# EAGLE design BPW5017-VGA (EAGLE 5.11)
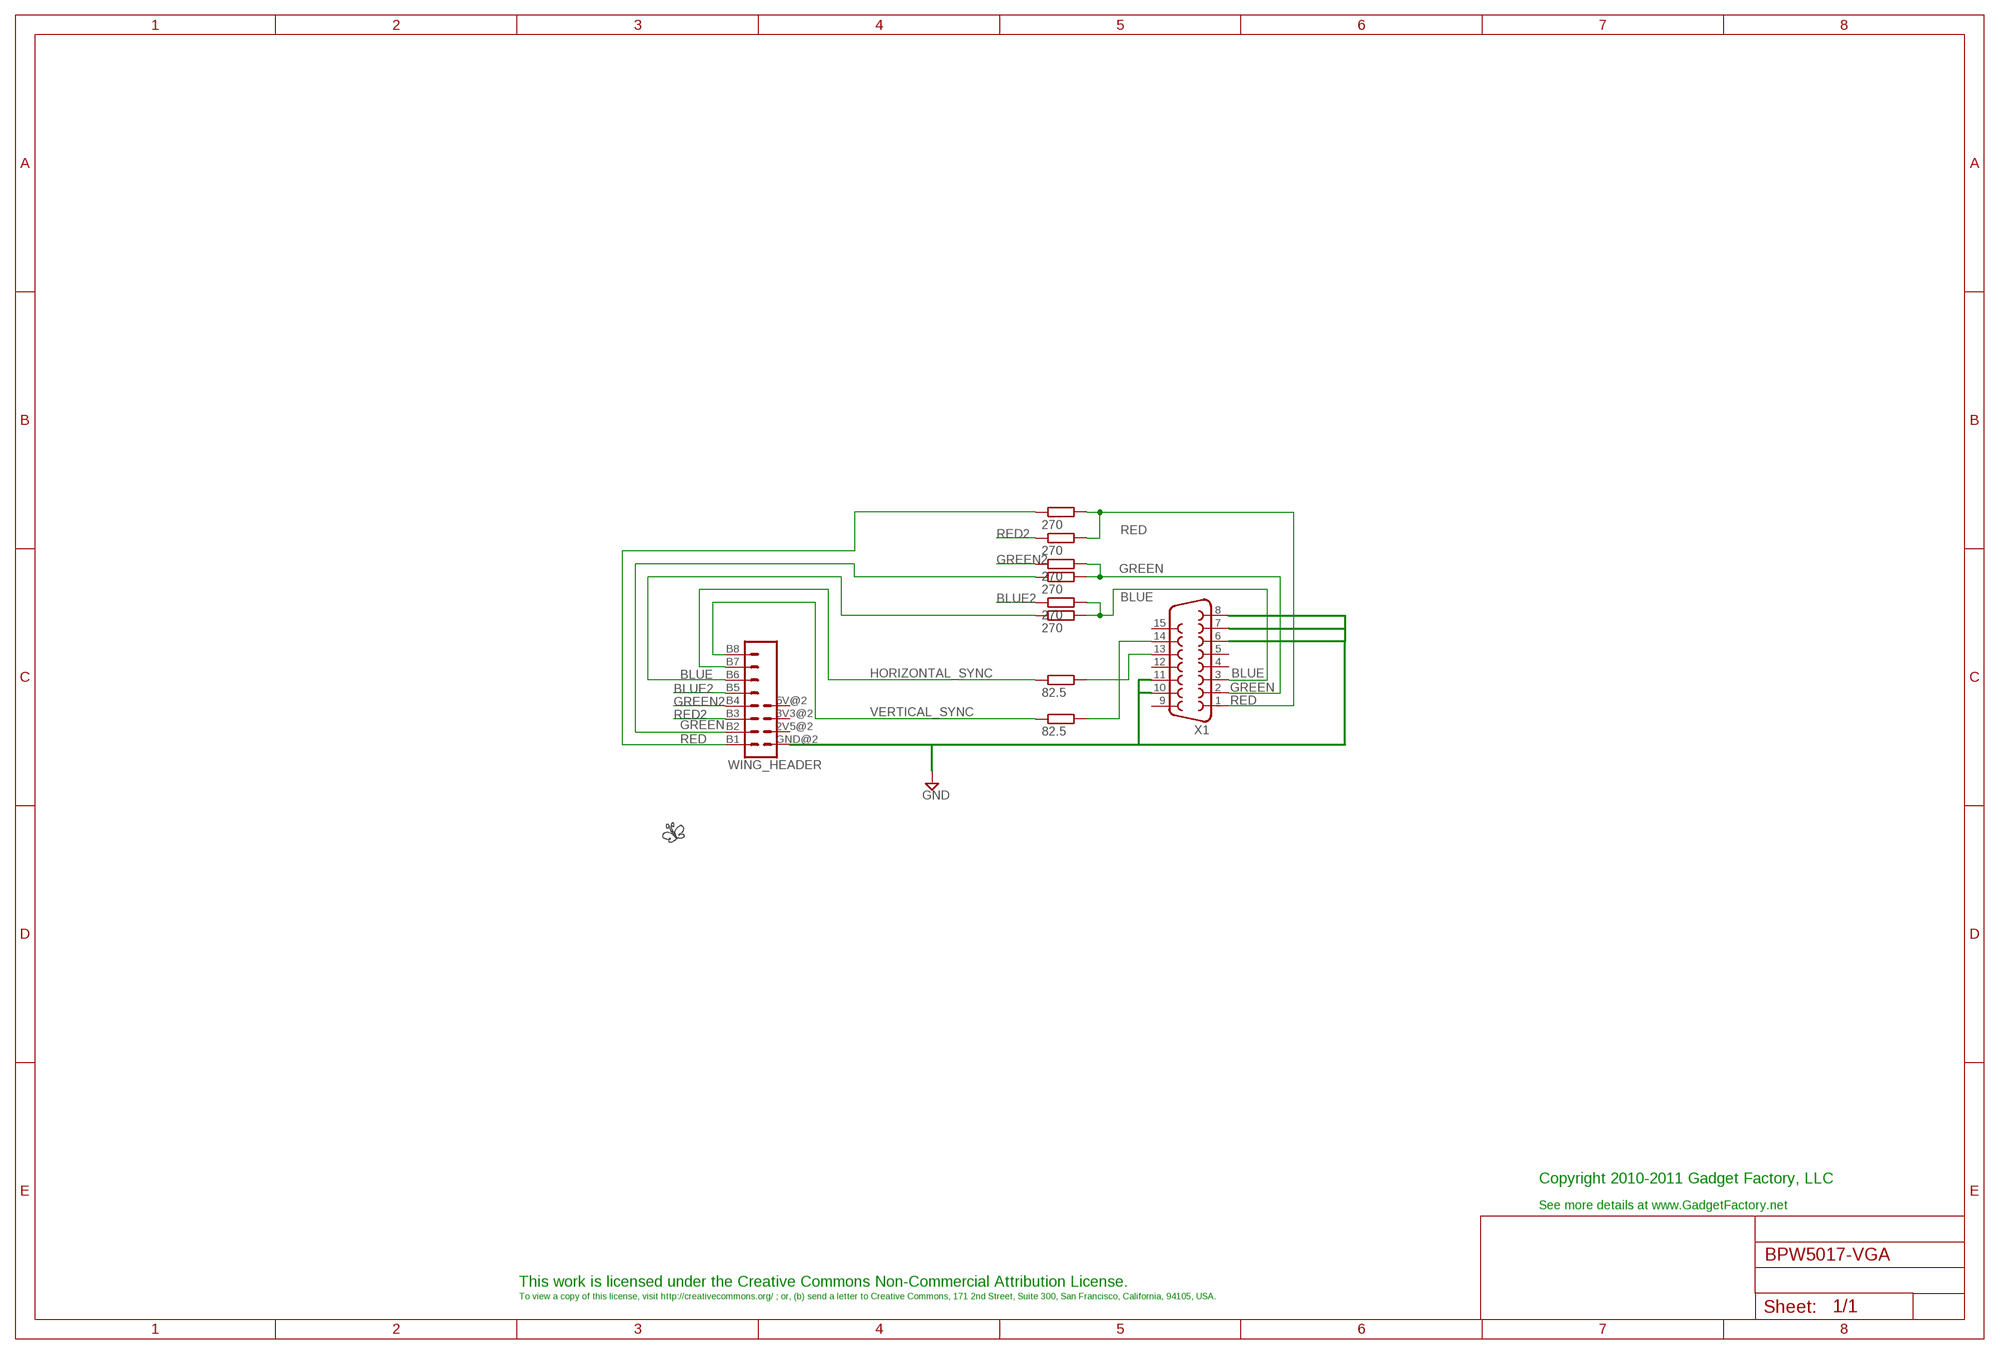
[diagram p0: schematic, sheet 1]

## Parts
LOGO2  BUTTERFLY_LOGO  [BUTTERFLY_LOGO]
R1  270  R-EU_0207/10  [0207/10]
R2  270  R-EU_0207/10  [0207/10]
R3  270  R-EU_0207/10  [0207/10]
R4  82.5  R-EU_0207/10  [0207/10]
R5  82.5  R-EU_0207/10  [0207/10]
R6  270  R-EU_0207/10  [0207/10]
R7  270  R-EU_0207/10  [0207/10]
R8  270  R-EU_0207/10  [0207/10]
WING_HEADER  WING_8BIT  [WINGSIDE_8BIT]
X1  F15HDH  [HDF15H]

## Nets
BLUE: R3.2 R8.2 X1.3
BLUE2: R8.1 WING_HEADER.B5
GND: WING_HEADER.GND@2(GND) X1.6 X1.7 X1.8 X1.10 X1.11
GREEN: R2.2 R7.2 X1.2
GREEN2: R7.1 WING_HEADER.B4
HORIZONTAL_SYNC: R4.1 WING_HEADER.B7
N$4: R4.2 X1.13
N$5: R5.2 X1.14
N$6: R1.1 WING_HEADER.B1
N$7: R2.1 WING_HEADER.B2
N$8: R3.1 WING_HEADER.B6
RED: R1.2 R6.2 X1.1
RED2: R6.1 WING_HEADER.B3
VERTICAL_SYNC: R5.1 WING_HEADER.B8
Unconnected: WING_HEADER.2V5@2(2V5) WING_HEADER.3V3@2(3V3) WING_HEADER.5V@2(5V) X1.4 X1.5 X1.9 X1.12 X1.15

## Notes on the sheet
- BLUE
- GREEN
- RED
- Copyright 2010-2011 Gadget Factory, LLC
- See more details at www.GadgetFactory.net
- This work is licensed under the Creative Commons Non-Commercial Attribution License.
- To view a copy of this license, visit http://creativecommons.org/ ; or, (b) send a letter to Creative Commons, 171 2nd Street, Suite 300, San Francisco, California, 94105, USA.

## Library data of the parts
LOGO2 = GadgetFactory_Pub:BUTTERFLY_LOGO
R1-R8 = resistor:R-EU_: RESISTOR, European symbol
WING_HEADER = GadgetFactory_Pub:WING_8BIT
X1 = con-subd:F15: SUB-D

## Board
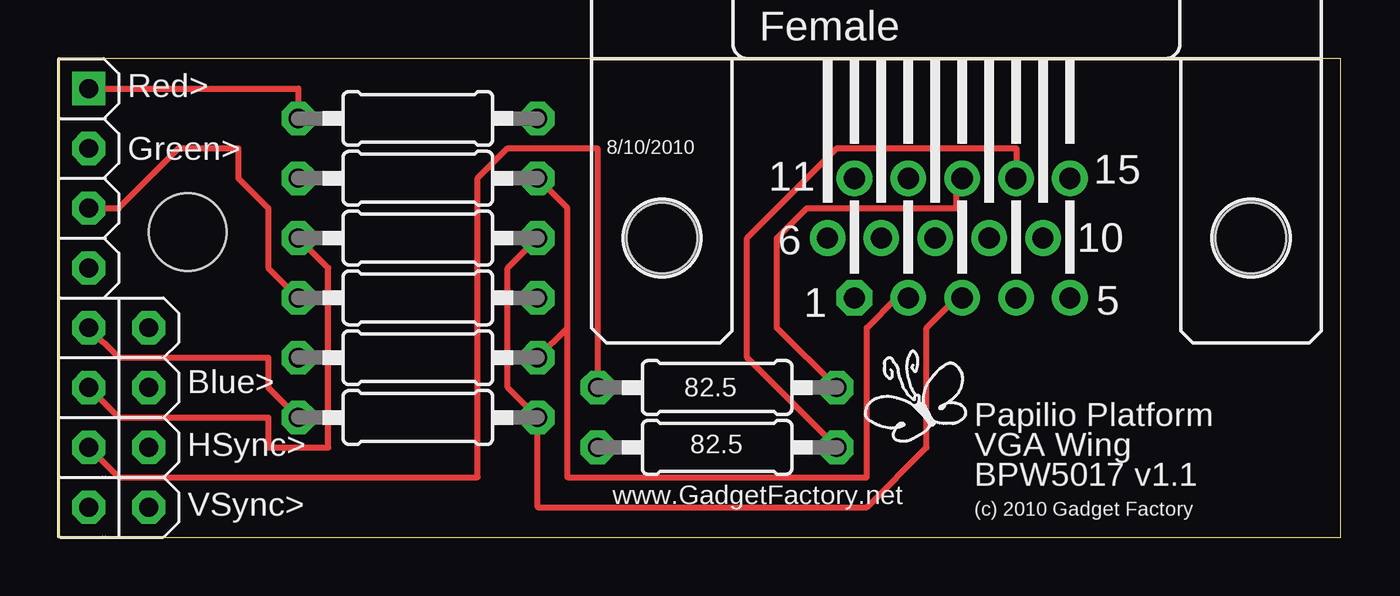
[diagram p1: board, top side]
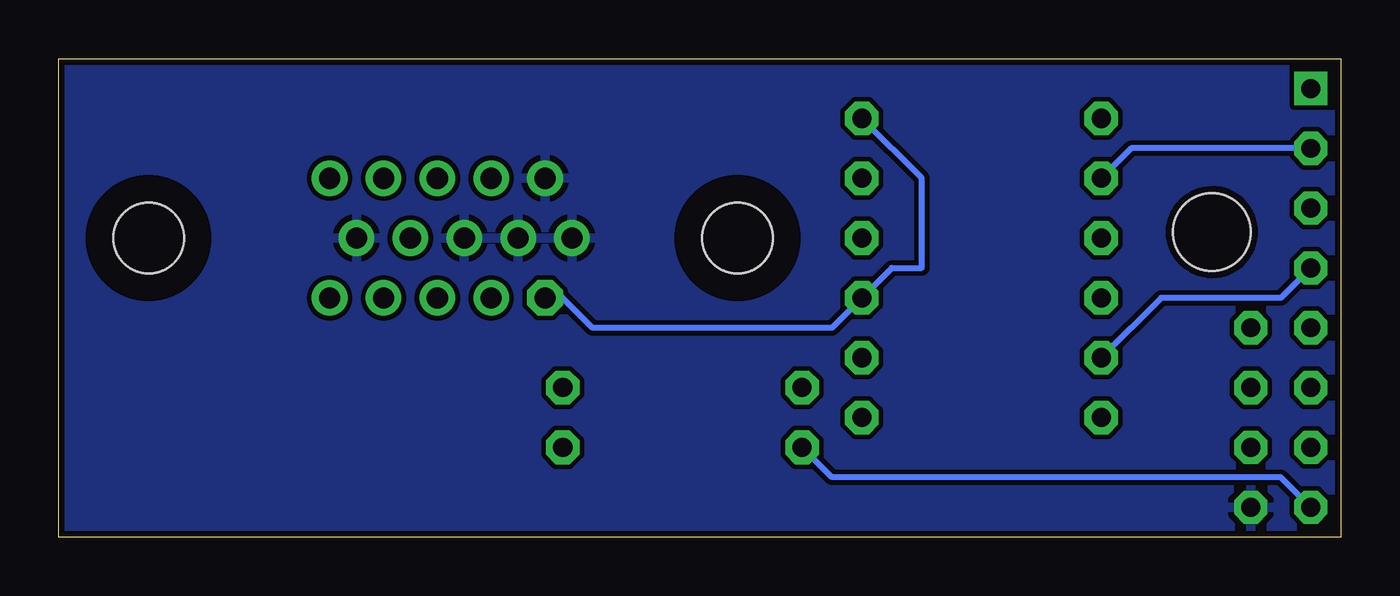
[diagram p2: board, bottom side, seen from below]

Size 54.41 x 20.31 mm. Coordinates in mm from the lower left corner, seen from the top.
Outline: 0,0 54.41,0 54.41,20.31 0,20.31 0,0
Copper layers (1*16): Top 0.035mm / dielectric 1.5mm / Bottom 0.035mm
Design rules "SparkFun_Derived_GoldePheonix_10mil": minimum track width 10mil, minimum drill 15mil, track to track 8mil, track to pad 8mil, pad to pad 8mil, via to via 8mil, smd to smd 8mil, copper to edge 10mil, drill to drill 8mil, minimum pad ring 12mil, minimum via ring 10mil, stop-mask expansion 4mil, vias tented up to drill 18mil, thermal gap 10mil

### Footprints (pad centres in the part's own frame; a part is rotated, then mirrored left to right if it is on the bottom)
0207/10 = drill 0.813 octagon: 1 -5.08,0; 2 5.08,0
WINGSIDE_8BIT = drill 0.8 octagon: 2V5@2 16.51,3.81; 3V3@2 13.97,3.81; 5V@2 11.43,3.81; B2 3.81,1.27; B3 6.35,1.27; B4 8.89,1.27; B5 11.43,1.27; B6 13.97,1.27; B7 16.51,1.27; B8 19.05,1.27; GND@2 19.05,3.81 | drill 0.8 square: B1 1.27,1.27 | hole 3.302: 7.366,5.461
HDF15H = drill 0.9 octagon: 1 4.329,2.54 | drill 0.9 round: 2 2.043,2.54; 3 -0.243,2.54; 4 -2.529,2.54; 5 -4.815,2.54; 6 5.472,0; 7 3.186,0; 8 0.9,0; 9 -1.386,0; 10 -3.672,0; 11 4.329,-2.54; 12 2.043,-2.54; 13 -0.243,-2.54; 14 -2.529,-2.54; 15 -4.815,-2.54 | hole 3: -12.5,0; 12.5,0

### Placement (x,y rotation side)
LOGO2  36.45,5.46 0 top
R1  15.24,17.78 0 top
R2  15.24,15.24 0 top
R3  15.24,12.7 0 top
R4  27.94,6.35 0 top
R5  27.94,3.81 0 top
R6  15.24,10.16 0 top
R7  15.24,7.62 0 top
R8  15.24,5.08 0 top
WING_HEADER  0,20.32 270 top
X1  38.1,12.7 180 top

### Tracks (layer width: path | path; a pad name or v marks a point on that pad's centre or on a via)
BLUE
  Top 0.254: R3.2 19.05,11.43 19.05,6.35 R8.2 20.32,1.27 34.29,1.27 36.83,3.81 36.83,8.89 38.1,10.16 X1.3
BLUE2
  Top 0.254: WING_HEADER.B5 2.54,7.62 8.89,7.62 8.89,6.35 R8.1
GND
  pour Bottom: 0,20.32 54.61,20.32 54.61,0 0,0
GREEN
  Top 0.254: 21.59,8.89 R7.2 | 21.59,8.89 21.59,13.97 R2.2 | 21.59,8.89 21.59,2.54 34.29,2.54 34.29,8.89 35.56,10.16 X1.2
GREEN2
  Bottom 0.254: WING_HEADER.B4 2.54,10.16 7.62,10.16 R7.1
HORIZONTAL_SYNC
  Top 0.254: WING_HEADER.B7 2.54,2.54 17.78,2.54 17.78,15.24 19.05,16.51 22.86,16.51 R4.1
N$4
  Top 0.254: R4.2 30.48,8.89 30.48,12.7 31.75,13.97 38.1,13.97 38.1,15.24 X1.13
N$5
  Top 0.254: R5.2 29.21,7.62 29.21,12.7 33.02,16.51 40.64,16.51 X1.14
N$6
  Top 0.254: WING_HEADER.B1 10.16,19.05 R1.1
N$7
  Bottom 0.254: WING_HEADER.B2 8.89,16.51 R2.1
N$8
  Top 0.254: WING_HEADER.B6 2.54,5.08 8.89,5.08 8.89,3.81 11.43,3.81 11.43,11.43 R3.1
RED
  Bottom 0.254: X1.1 33.02,10.16 31.75,8.89 21.59,8.89 R6.2 19.05,11.43 17.78,11.43 17.78,15.24 R1.2
RED2
  Top 0.254: WING_HEADER.B3 2.54,13.97 5.08,16.51 7.62,16.51 7.62,15.24 8.89,13.97 8.89,11.43 R6.1
VERTICAL_SYNC
  Bottom 0.254: WING_HEADER.B8 2.54,2.54 21.59,2.54 R5.1

### Text on the board
tPlace: Red> | Green> | 8/10/2010 | Blue> | 82.5 | Papilio Platform | 82.5 | HSync> | VGA Wing | BPW5017 v1.1 | VSync> | www.GadgetFactory.net | (c) 2010 Gadget Factory